# Altium project BEAGLEPLAYV020_220915.PrjPcb (part 8 of 10)

## Sheet 017_SoC CSI & OLDI.SchDoc
size 420 x 297 mm; Page Create Date: May 29, 2006; WebSite: https://www.seeedstudio.com; Variant Name: <Core Design>; Page Number: 17; Drawing: qxn; Schematic Name: BeaglePlay; Page Size: A3; Comment: Seeed Title; Page Count: 22; Page Name: 017_SoC CSI & OLDI; Company: Seeed Studio; RevCode: v0.2; DsnPath: C:\Users\a0488739\Documents\GitHub\beagleplay\allegro\DVT\BEAGLEPLAYV020_220915.DSN; SchematicName: BeaglePlay; PageName: 017_SoC CSI & OLDI; PageSize: A3; TopSchematic: True
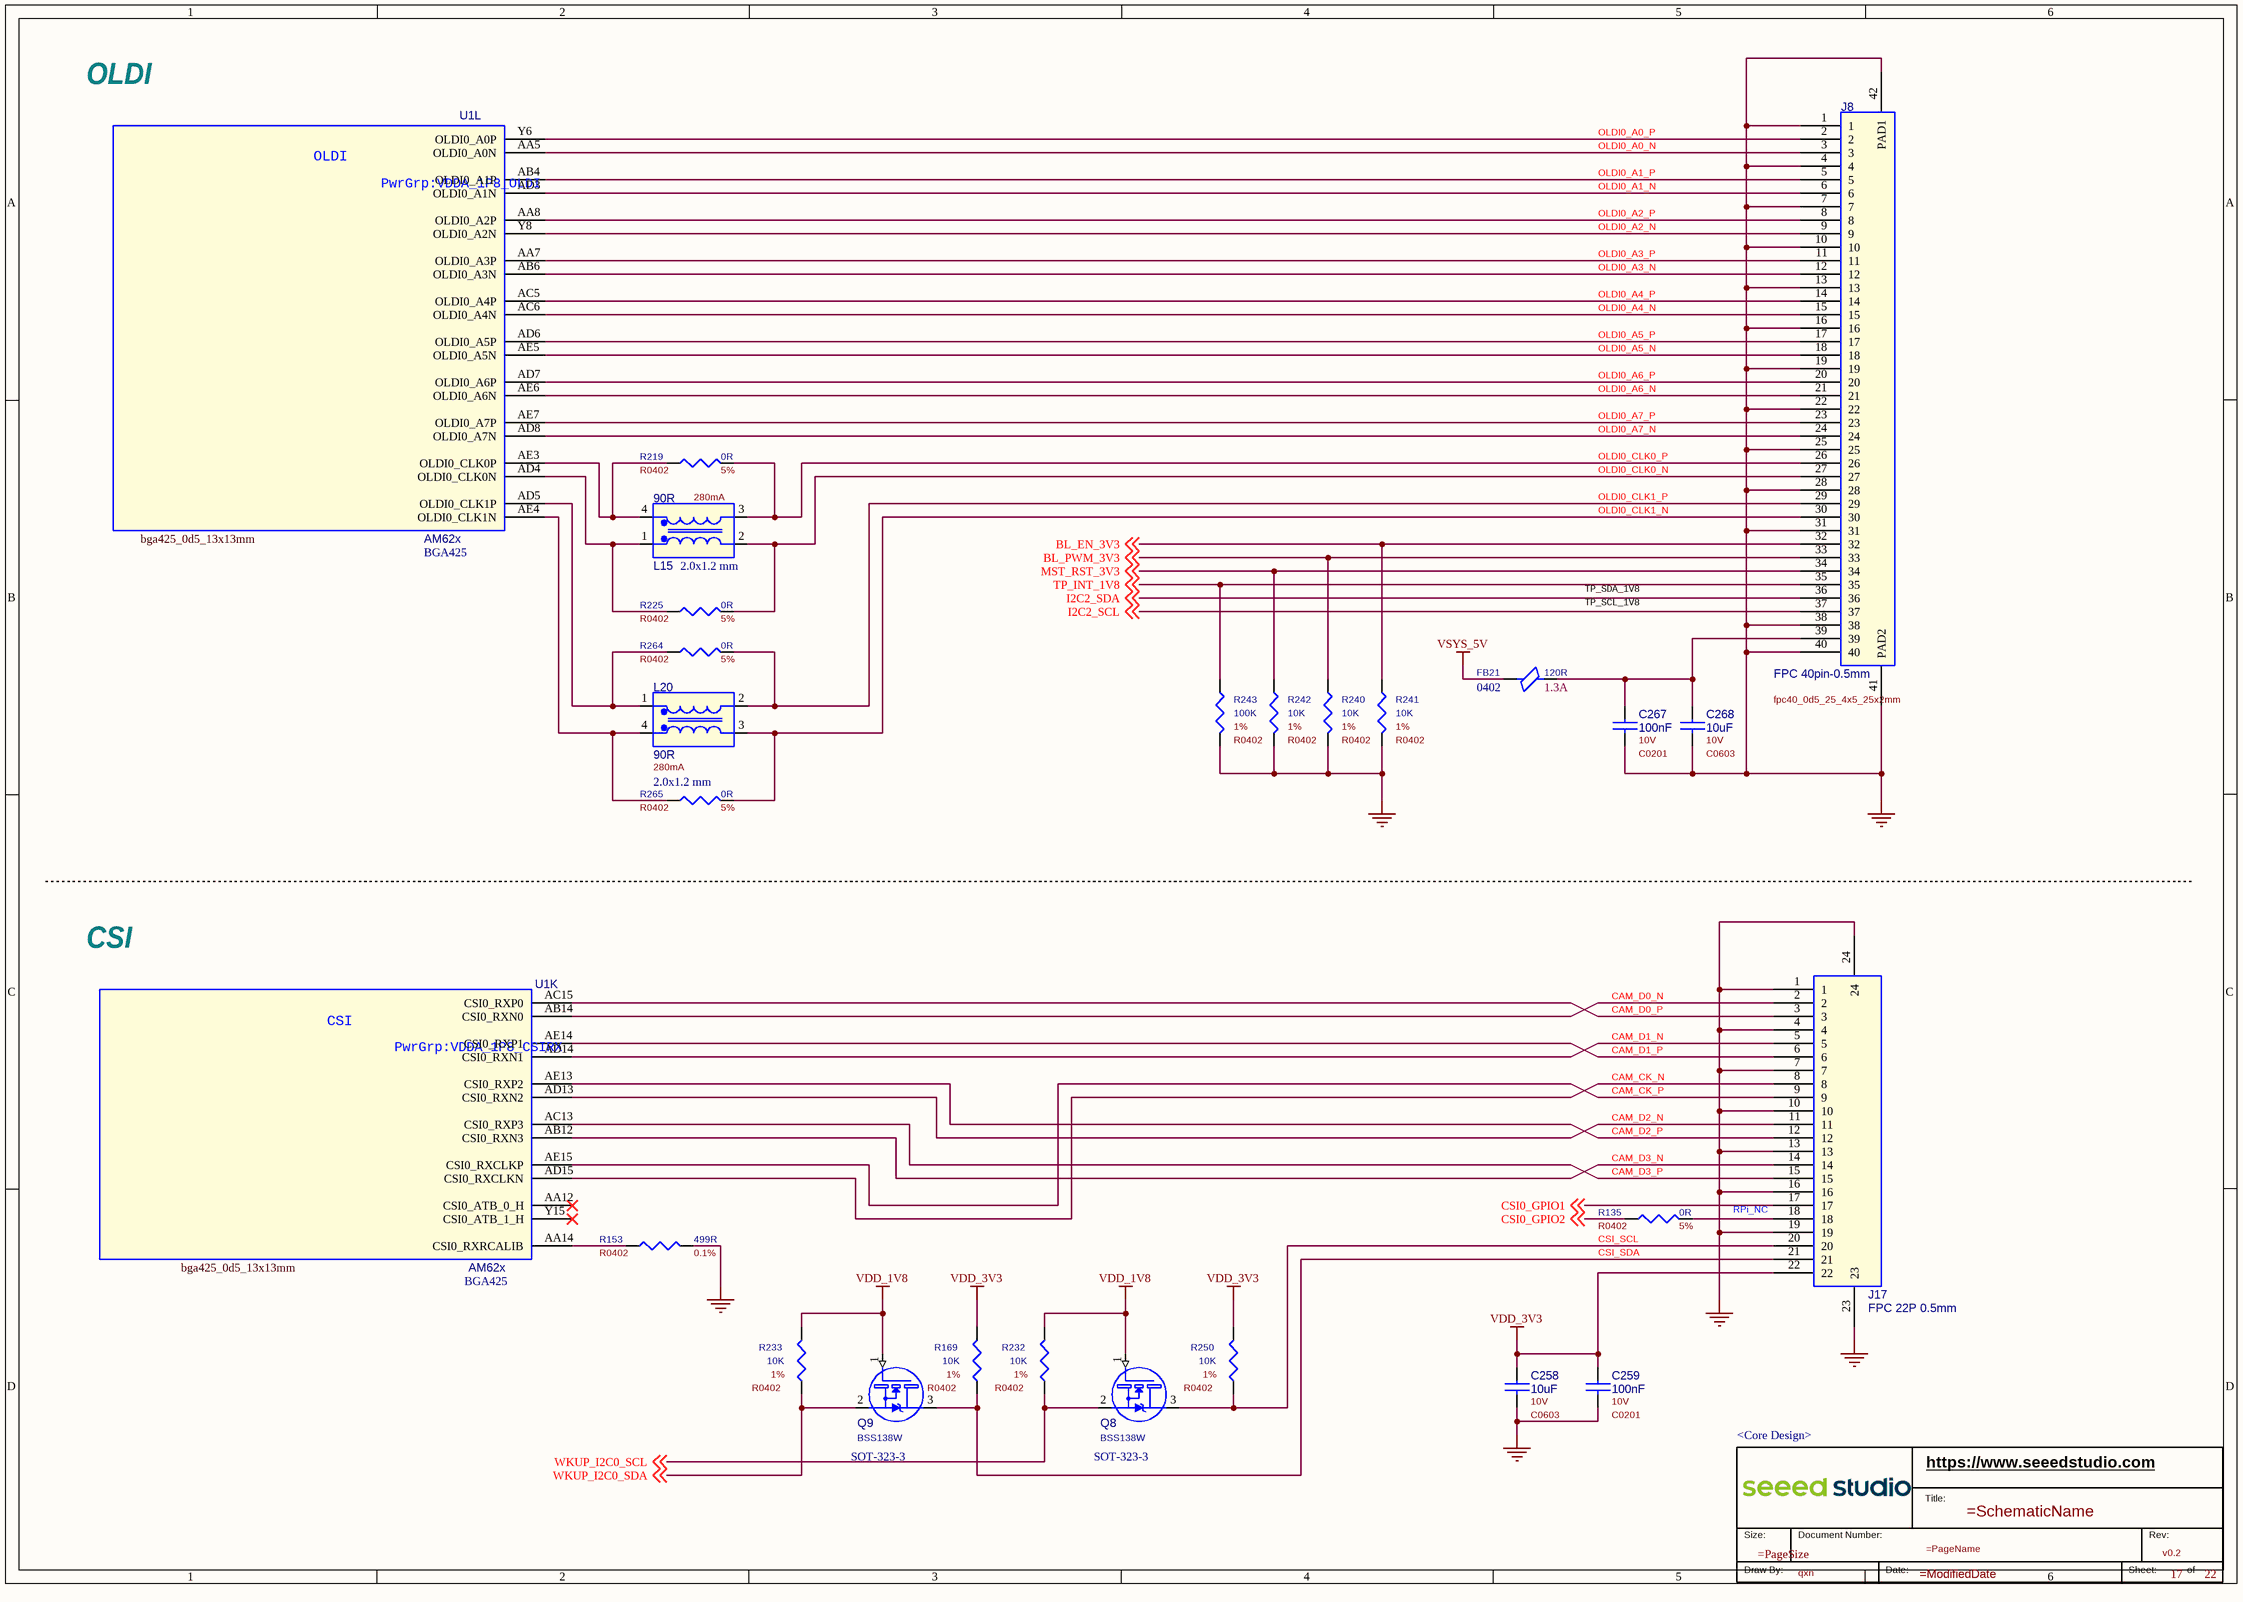
[diagram p16: 017_SoC CSI & OLDI.SchDoc]

### Parts
(Parts that share a designator on the sheet are numbered #1, #2 ... from top to bottom, then left to right.)
*#17  RevCode: v0.2  Page Number: 17  Page Count: 22  Drawing: qxn  Variant Name: <Core Design>  (hidden comment: Seeed Title)  (graphical)
C258  value 10uF  Rating: 10V  [C0603]  (hidden comment: CC)
C259  value 100nF  Rating: 10V  [C0201]  (hidden comment: CC)
C267  value 100nF  Rating: 10V  [C0201]  (hidden comment: CC)
C268  value 10uF  Rating: 10V  [C0603]  (hidden comment: CC)
FB21  value 120R  Rating: 1.3A  Package Size: 0402  [L0402]  (hidden comment: FB)
J8  value FPC 40pin-0.5mm  [fpc40_0d5_25_4x5_25x2mm]  (hidden comment: Header 40+2P)
J17  value FPC 22P 0.5mm  [fpc22_0d5_15_4x5_25x2mm_0d5_dx_npwb]  (hidden comment: FPC 22+2P)
L15  value 90R  Rating: 280mA  Package Size: 2.0x1.2 mm  [L2012]  (hidden comment: CL)
L20  value 90R  Rating: 280mA  Package Size: 2.0x1.2 mm  [L2012]  (hidden comment: CL)
Q8  value BSS138W  [SOT-323-3]  (hidden comment: NMOS_123)
Q9  value BSS138W  [SOT-323-3]  (hidden comment: NMOS_123)
R135  value 0R  Rating: 5%  [R0402]  (hidden comment: R)
R153  value 499R  Rating: 0.1%  [R0402]  (hidden comment: R)
R169  value 10K  Rating: 1%  [R0402]  (hidden comment: R)
R219  value 0R  Rating: 5%  [R0402]  (hidden comment: R)
R225  value 0R  Rating: 5%  [R0402]  (hidden comment: R)
R232  value 10K  Rating: 1%  [R0402]  (hidden comment: R)
R233  value 10K  Rating: 1%  [R0402]  (hidden comment: R)
R240  value 10K  Rating: 1%  [R0402]  (hidden comment: R)
R241  value 10K  Rating: 1%  [R0402]  (hidden comment: R)
R242  value 10K  Rating: 1%  [R0402]  (hidden comment: R)
R243  value 100K  Rating: 1%  [R0402]  (hidden comment: R)
R250  value 10K  Rating: 1%  [R0402]  (hidden comment: R)
R264  value 0R  Rating: 5%  [R0402]  (hidden comment: R)
R265  value 0R  Rating: 5%  [R0402]  (hidden comment: R)
U1  value AM62x  Package Size: BGA425  [bga425_0d5_13x13mm]  (hidden comment: AM62x_BGA425)  (parts K,L of 19)

### Nets
GND: C258.2 C259.2 C267.2 C268.2 J8.1 J8.4 J8.7 J8.10 J8.13 J8.16 J8.19 J8.22 J8.25 J8.28 J8.31 J8.38 J8.40 J8.41(PAD2) J8.42(PAD1) J17.1 J17.4 J17.7 J17.10 J17.13 J17.16 J17.19 J17.23 J17.24 R153.2 R240.2 R241.2 R242.2 R243.2
VDD_1V8: Q8.1(G) Q9.1(G) R232.1 R233.1
VDD_3V3: C258.1 C259.1 J17.22 R169.1 R250.1
VSYS_5V: FB21.1
BL_EN_3V3: J8.32 R241.1 ; off-sheet BL_EN_3V3
BL_PWM_3V3: J8.33 R240.1 ; off-sheet BL_PWM_3V3
CAM_CK_N: J17.8 U1.AD15(CSI0_RXCLKN)
CAM_CK_P: J17.9 U1.AE15(CSI0_RXCLKP)
CAM_D0_N: J17.2 U1.AB14(CSI0_RXN0)
CAM_D0_P: J17.3 U1.AC15(CSI0_RXP0)
CAM_D1_N: J17.5 U1.AD14(CSI0_RXN1)
CAM_D1_P: J17.6 U1.AE14(CSI0_RXP1)
CAM_D2_N: J17.11 U1.AD13(CSI0_RXN2)
CAM_D2_P: J17.12 U1.AE13(CSI0_RXP2)
CAM_D3_N: J17.14 U1.AB12(CSI0_RXN3)
CAM_D3_P: J17.15 U1.AC13(CSI0_RXP3)
CSI0_GPIO1: J17.17 ; off-sheet CSI0_GPIO1
CSI0_GPIO2: R135.1 ; off-sheet CSI0_GPIO2
CSI_SCL: J17.20 Q8.3(D) R250.2
CSI_SDA: J17.21 Q9.3(D) R169.2
I2C2_SCL: J8.37 ; off-sheet I2C2_SCL
I2C2_SDA: J8.36 ; off-sheet I2C2_SDA
MST_RST_3V3: J8.34 R242.1 ; off-sheet MST_RST_3V3
OLDI0_A0_N: J8.3 U1.AA5(OLDI0_A0N)
OLDI0_A0_P: J8.2 U1.Y6(OLDI0_A0P)
OLDI0_A1_N: J8.6 U1.AD3(OLDI0_A1N)
OLDI0_A1_P: J8.5 U1.AB4(OLDI0_A1P)
OLDI0_A2_N: J8.9 U1.Y8(OLDI0_A2N)
OLDI0_A2_P: J8.8 U1.AA8(OLDI0_A2P)
OLDI0_A3_N: J8.12 U1.AB6(OLDI0_A3N)
OLDI0_A3_P: J8.11 U1.AA7(OLDI0_A3P)
OLDI0_A4_N: J8.15 U1.AC6(OLDI0_A4N)
OLDI0_A4_P: J8.14 U1.AC5(OLDI0_A4P)
OLDI0_A5_N: J8.18 U1.AE5(OLDI0_A5N)
OLDI0_A5_P: J8.17 U1.AD6(OLDI0_A5P)
OLDI0_A6_N: J8.21 U1.AE6(OLDI0_A6N)
OLDI0_A6_P: J8.20 U1.AD7(OLDI0_A6P)
OLDI0_A7_N: J8.24 U1.AD8(OLDI0_A7N)
OLDI0_A7_P: J8.23 U1.AE7(OLDI0_A7P)
OLDI0_CLK0_N: J8.27 L15.2 R225.2
OLDI0_CLK0_P: J8.26 L15.3 R219.2
OLDI0_CLK1_N: J8.30 L20.3 R265.2
OLDI0_CLK1_P: J8.29 L20.2 R264.2
TP_INT_1V8: J8.35 R243.1 ; off-sheet TP_INT_1V8
WKUP_I2C0_SCL: Q8.2(S) R232.2 ; off-sheet WKUP_I2C0_SCL
WKUP_I2C0_SDA: Q9.2(S) R233.2 ; off-sheet WKUP_I2C0_SDA
NetC267_1: C267.1 C268.1 FB21.2 J8.39
NetJ17_18: J17.18 R135.2
NetL15_1: L15.1 R225.1 U1.AD4(OLDI0_CLK0N)
NetL15_4: L15.4 R219.1 U1.AE3(OLDI0_CLK0P)
NetL20_1: L20.1 R264.1 U1.AD5(OLDI0_CLK1P)
NetL20_4: L20.4 R265.1 U1.AE4(OLDI0_CLK1N)
NetR153_1: R153.1 U1.AA14(CSI0_RXRCALIB)

Not connected (* = marked no-connect by the designer): U1 AA12(CSI0_ATB_0_H)* Y15(CSI0_ATB_1_H)*

### Notes on the sheet
- OLDI
- TP_SDA_1V8
- TP_SCL_1V8
- CSI
- RPi_NC
- (in symbol AM62x_BGA425, part K) CSI; PwrGrp:VDDA_1P8_CSIRX
- (in symbol AM62x_BGA425, part L) OLDI; PwrGrp:VDDA_1P8_OLDI
- (in symbol Seeed Title) https://www.seeedstudio.com; Title:; Size:; Document Number:; Rev:; Draw By:; Date:; Sheet:; of

### Library data of the parts
*#17 = Seeed Title: Company: Seeed Studio; WebSite: https://www.seeedstudio.com; Schematic Name: =SchematicName; Page Size: =PageSize; Page Name: =PageName; Page Create Date: May 29, 2006; Page Modify Date: =ModifiedDate
C258 = CC: CAP, Ceramic, SMD, 10uF, 10%, 10V, 0603; Part Reference: C258; Manufacturer PN: CC0603KRX5R6BB106; Company Part Status: BeagleBone Carrier Board; Manufacturer: YAGEO; Manufacturer Part Number: CC0805MKX7R7BB106; CLASS: DISCRETE; Temperature Coefficient: X5R; PN: 302010103; PCB Footprint: C0603; Tolerance: 10%; Dielectric Type: Ceramic; Package Size: 0603; Part Type: Ceramic; Status: Sensecap Gateway V1; Temperature: -55¡ãC to 125¡ãC
C259 = CC: CAP, Ceramic, SMD, 100nF, 10%, 10V, 0201; Part Reference: C259; Manufacturer PN: CC0201KRX5R6BB104; Company Part Status: ODYSSEY-i.MX8M; Manufacturer: YAGEO; CLASS: DISCRETE; Temperature Coefficient: X5R; PN: 302010271; PCB Footprint: C0201; Tolerance: 10%; Dielectric Type: Ceramic; Package Size: 0201; Temperature: -55¡ãC to 85¡ãC; Status: ODYSSEY-i.MX8M; Part Type: Ceramic; Manufacturer Part Number: CC0201KRX5R6BB104
C267 = CC: CAP, Ceramic, SMD, 100nF, 10%, 10V, 0201; Part Reference: C267; Manufacturer PN: CC0201KRX5R6BB104; Manufacturer: YAGEO; Company Part Status: ODYSSEY-i.MX8M; CLASS: DISCRETE; Temperature Coefficient: X5R; PN: 302010271; PCB Footprint: C0201; Tolerance: 10%; Dielectric Type: Ceramic; Package Size: 0201
C268 = CC: CAP, Ceramic, SMD, 10uF, 10%, 10V, 0603; Part Reference: C268; Manufacturer PN: CC0603KRX5R6BB106; Manufacturer: YAGEO; Company Part Status: BeagleBone Carrier Board; CLASS: DISCRETE; Temperature Coefficient: X5R; PN: 302010103; PCB Footprint: C0603; Tolerance: 10%; Dielectric Type: Ceramic; Package Size: 0603
FB21 = FB: Ferrite Bead, 120R, , 1.3A, 0402; Part Reference: FB21; Company Part Status: BeagleBone Carrier Board; Manufacturer: Murata; Manufacturer PN: BLM15PD121SN1D; PN: 303030040; CLASS: DISCRETE; PCB Footprint: L0402
J8 = Header 40+2P: CONN, FPC Connectors, 0.5K-DX-40PWB, 40P, SMD; Part Reference: J8; Company Part Status: BeaglePlay; Manufacturer: BEST Electronics; PN: 320060264; CLASS: IO; PCB Footprint: fpc40_0d5_25_4x5_25x2mm; Package Size: 40P-0.50mm; Manufacturer PN: 0.5K-DX-40PWB
J17 = FPC 22+2P: CONN, FPC Connectors, FPC 22P 0.5mm, 22P+2P, SMD; Part Reference: J17; Manufacturer Part Number: 0.5K-DX-22PWB; Manufacturer: BEST Electronics; Company Part Status: BeaglePlay; Priority: A; PN: 320060764; CLASS: IO; PCB Footprint: fpc22_0d5_15_4x5_25x2mm_0d5_dx_npwb; Temperature: -25¡ãC to 85¡ãC; Status: BeagleBone AI TDA4VM; Part Type: FPC Connector; Package Size: 20P-0.5mm; Manufacturer PN: 0.5K-DX-22PWB
L15 = CL: Common Mode Filter, 90R, --, 280mA, 2.0x1.2 mm; Part Reference: L15; Company Part Status: BBAI; Manufacturer: Murata; Manufacturer PN: DLW21SN900HQ2L; PN: 303050266; CLASS: DISCRETE; PCB Footprint: L2012
L20 = CL: Common Mode Filter, 90R, --, 280mA, 2.0x1.2 mm; Part Reference: L20; Manufacturer PN: DLW21SN900HQ2L; Manufacturer: Murata; Company Part Status: BBAI; CLASS: DISCRETE; PN: 303050266; PCB Footprint: L2012
Q8 = NMOS_123: XSTR, MOSFET, N-Channel, BSS138W, 50V, 200mA, SOT-323-3, SMD; Part Reference: Q8; Company Part Status: BeagleBone Carrier Board; Manufacturer: Diodes; Manufacturer PN: BSS138W-7-F; PN: 305030000; CLASS: DISCRETE; PCB Footprint: SOT-323-3; Package Size: SOT-323-3; Polarity: N-Channel
Q9 = NMOS_123: XSTR, MOSFET, N-Channel, BSS138W, 50V, 200mA, SOT-323-3, SMD; Part Reference: Q9; Company Part Status: BeagleBone Carrier Board; Manufacturer: Diodes; Manufacturer PN: BSS138W-7-F; PN: 305030000; CLASS: DISCRETE; PCB Footprint: SOT-323-3; Package Size: SOT-323-3; Polarity: N-Channel
R135 = R: RES, Thick Film, 0R, 5%, 1/16W, SMD, 0402; Part Reference: R135; Manufacturer PN: RC0402JR-070RL; Company Part Status: BeagleBone Carrier Board; Manufacturer Part Number: RC0201FR-070RL; Manufacturer: YAGEO; CLASS: DISCRETE; PN: 301010000; PCB Footprint: R0402; Rated Power: 1/16W; Package Size: 0402; Temperature: -55¡ãC to 125¡ãC; Status: BeagleBone AI TDA4VM; Part Type: RES
R153 = R: RES, Thick Film, 499R, 0.1%, 1/16W, SMD, 0402; Part Reference: R153; Company Part Status: Beaglebone LoRa Gateway; Manufacturer: YAGEO; Manufacturer PN: RT0402BRE07499RL; PN: 301010848; CLASS: DISCRETE; PCB Footprint: R0402; Package Size: 0402; Rated Power: 1/16W
R169 = R: RES, Thick Film, 10K, 1%, 1/16W, SMD, 0402; Part Reference: R169; Company Part Status: BeagleBone Carrier Board; Manufacturer: YAGEO; Manufacturer PN: RC0402FR-0710KL; PN: 301010047; CLASS: DISCRETE; PCB Footprint: R0402; Package Size: 0402; Rated Power: 1/16W
R219 = R: RES, Thick Film, 0R, 5%, 1/16W, SMD, 0402; Part Reference: R219; Manufacturer: YAGEO; Manufacturer Part Number: RC0201FR-070RL; Company Part Status: BeagleBone Carrier Board; Manufacturer PN: RC0402JR-070RL; PN: 301010000; CLASS: DISCRETE; PCB Footprint: R0402; Part Type: RES; Status: BeagleBone AI TDA4VM; Temperature: -55¡ãC to 125¡ãC; Package Size: 0402; Rated Power: 1/16W
R225 = R: RES, Thick Film, 0R, 5%, 1/16W, SMD, 0402; Part Reference: R225; Manufacturer: YAGEO; Manufacturer Part Number: RC0201FR-070RL; Company Part Status: BeagleBone Carrier Board; Manufacturer PN: RC0402JR-070RL; PN: 301010000; CLASS: DISCRETE; PCB Footprint: R0402; Part Type: RES; Status: BeagleBone AI TDA4VM; Temperature: -55¡ãC to 125¡ãC; Package Size: 0402; Rated Power: 1/16W
R232 = R: RES, Thick Film, 10K, 1%, 1/16W, SMD, 0402; Part Reference: R232; Manufacturer PN: RC0402FR-0710KL; Manufacturer: YAGEO; Company Part Status: BeagleBone Carrier Board; CLASS: DISCRETE; PN: 301010047; PCB Footprint: R0402; Package Size: 0402; Rated Power: 1/16W
R233 = R: RES, Thick Film, 10K, 1%, 1/16W, SMD, 0402; Part Reference: R233; Manufacturer PN: RC0402FR-0710KL; Manufacturer: YAGEO; Company Part Status: BeagleBone Carrier Board; CLASS: DISCRETE; PN: 301010047; PCB Footprint: R0402; Package Size: 0402; Rated Power: 1/16W
R240 = R: RES, Thick Film, 10K, 1%, 1/16W, SMD, 0402; Part Reference: R240; Manufacturer PN: RC0402FR-0710KL; Company Part Status: BeagleBone Carrier Board; Manufacturer Part Number: RC0201FR-0710KL; Manufacturer: YAGEO; CLASS: DISCRETE; PN: 301010047; PCB Footprint: R0402; Package Size: 0402; Temperature: -55¡ãC to 125¡ãC; Status: BeagleBone AI TDA4VM; Part Type: RES; Rated Power: 1/16W
R241 = R: RES, Thick Film, 10K, 1%, 1/16W, SMD, 0402; Part Reference: R241; Manufacturer PN: RC0402FR-0710KL; Company Part Status: BeagleBone Carrier Board; Manufacturer Part Number: RC0201FR-0710KL; Manufacturer: YAGEO; CLASS: DISCRETE; PN: 301010047; PCB Footprint: R0402; Package Size: 0402; Temperature: -55¡ãC to 125¡ãC; Status: BeagleBone AI TDA4VM; Part Type: RES; Rated Power: 1/16W
R242 = R: RES, Thick Film, 10K, 1%, 1/16W, SMD, 0402; Part Reference: R242; Manufacturer PN: RC0402FR-0710KL; Company Part Status: BeagleBone Carrier Board; Manufacturer Part Number: RC0201FR-0710KL; Manufacturer: YAGEO; CLASS: DISCRETE; PN: 301010047; PCB Footprint: R0402; Package Size: 0402; Temperature: -55¡ãC to 125¡ãC; Status: BeagleBone AI TDA4VM; Part Type: RES; Rated Power: 1/16W
R243 = R: RES, Thick Film, 100K, 1%, 1/16W, SMD, 0402; Part Reference: R243; Manufacturer PN: RC0402FR-07100KL; Company Part Status: BeagleBone Carrier Board; Manufacturer Part Number: RC0201FR-0710KL; Manufacturer: YAGEO; CLASS: DISCRETE; PN: 301010456; PCB Footprint: R0402; Package Size: 0402; Temperature: -55¡ãC to 125¡ãC; Status: BeagleBone AI TDA4VM; Part Type: RES; Rated Power: 1/16W
R250 = R: RES, Thick Film, 10K, 1%, 1/16W, SMD, 0402; Part Reference: R250; Company Part Status: BeagleBone Carrier Board; Manufacturer: YAGEO; Manufacturer PN: RC0402FR-0710KL; PN: 301010047; CLASS: DISCRETE; PCB Footprint: R0402; Package Size: 0402; Rated Power: 1/16W
R264 = R: RES, Thick Film, 0R, 5%, 1/16W, SMD, 0402; Part Reference: R264; Manufacturer: YAGEO; Manufacturer Part Number: RC0201FR-070RL; Company Part Status: BeagleBone Carrier Board; Manufacturer PN: RC0402JR-070RL; PN: 301010000; CLASS: DISCRETE; PCB Footprint: R0402; Part Type: RES; Status: BeagleBone AI TDA4VM; Temperature: -55¡ãC to 125¡ãC; Package Size: 0402; Rated Power: 1/16W
R265 = R: RES, Thick Film, 0R, 5%, 1/16W, SMD, 0402; Part Reference: R265; Manufacturer: YAGEO; Manufacturer Part Number: RC0201FR-070RL; Company Part Status: BeagleBone Carrier Board; Manufacturer PN: RC0402JR-070RL; PN: 301010000; CLASS: DISCRETE; PCB Footprint: R0402; Part Type: RES; Status: BeagleBone AI TDA4VM; Temperature: -55¡ãC to 125¡ãC; Package Size: 0402; Rated Power: 1/16W
U1 = AM62x_BGA425: IC, Controller, MPU, AM62x, BGA425; Part Reference: U1; Manufacturer PN: AM6254ATCGGHALWR; Manufacturer: TI; Company Part Status: BeaglePlay; PN: 310011537; PCB Footprint: bga425_0d5_13x13mm; CLASS: IC

## Sheet 018_RTC & ID & DEBUG.SchDoc
size 420 x 297 mm; Page Create Date: May 29, 2006; WebSite: https://www.seeedstudio.com; Variant Name: <Core Design>; Page Number: 18; Drawing: qxn; Schematic Name: BeaglePlay; Page Size: A3; Comment: Seeed Title; Page Count: 22; Page Name: 018_RTC & ID & DEBUG; Company: Seeed Studio; RevCode: v0.2; DsnPath: C:\Users\a0488739\Documents\GitHub\beagleplay\allegro\DVT\BEAGLEPLAYV020_220915.DSN; SchematicName: BeaglePlay; PageName: 018_RTC & ID & DEBUG; PageSize: A3; TopSchematic: True
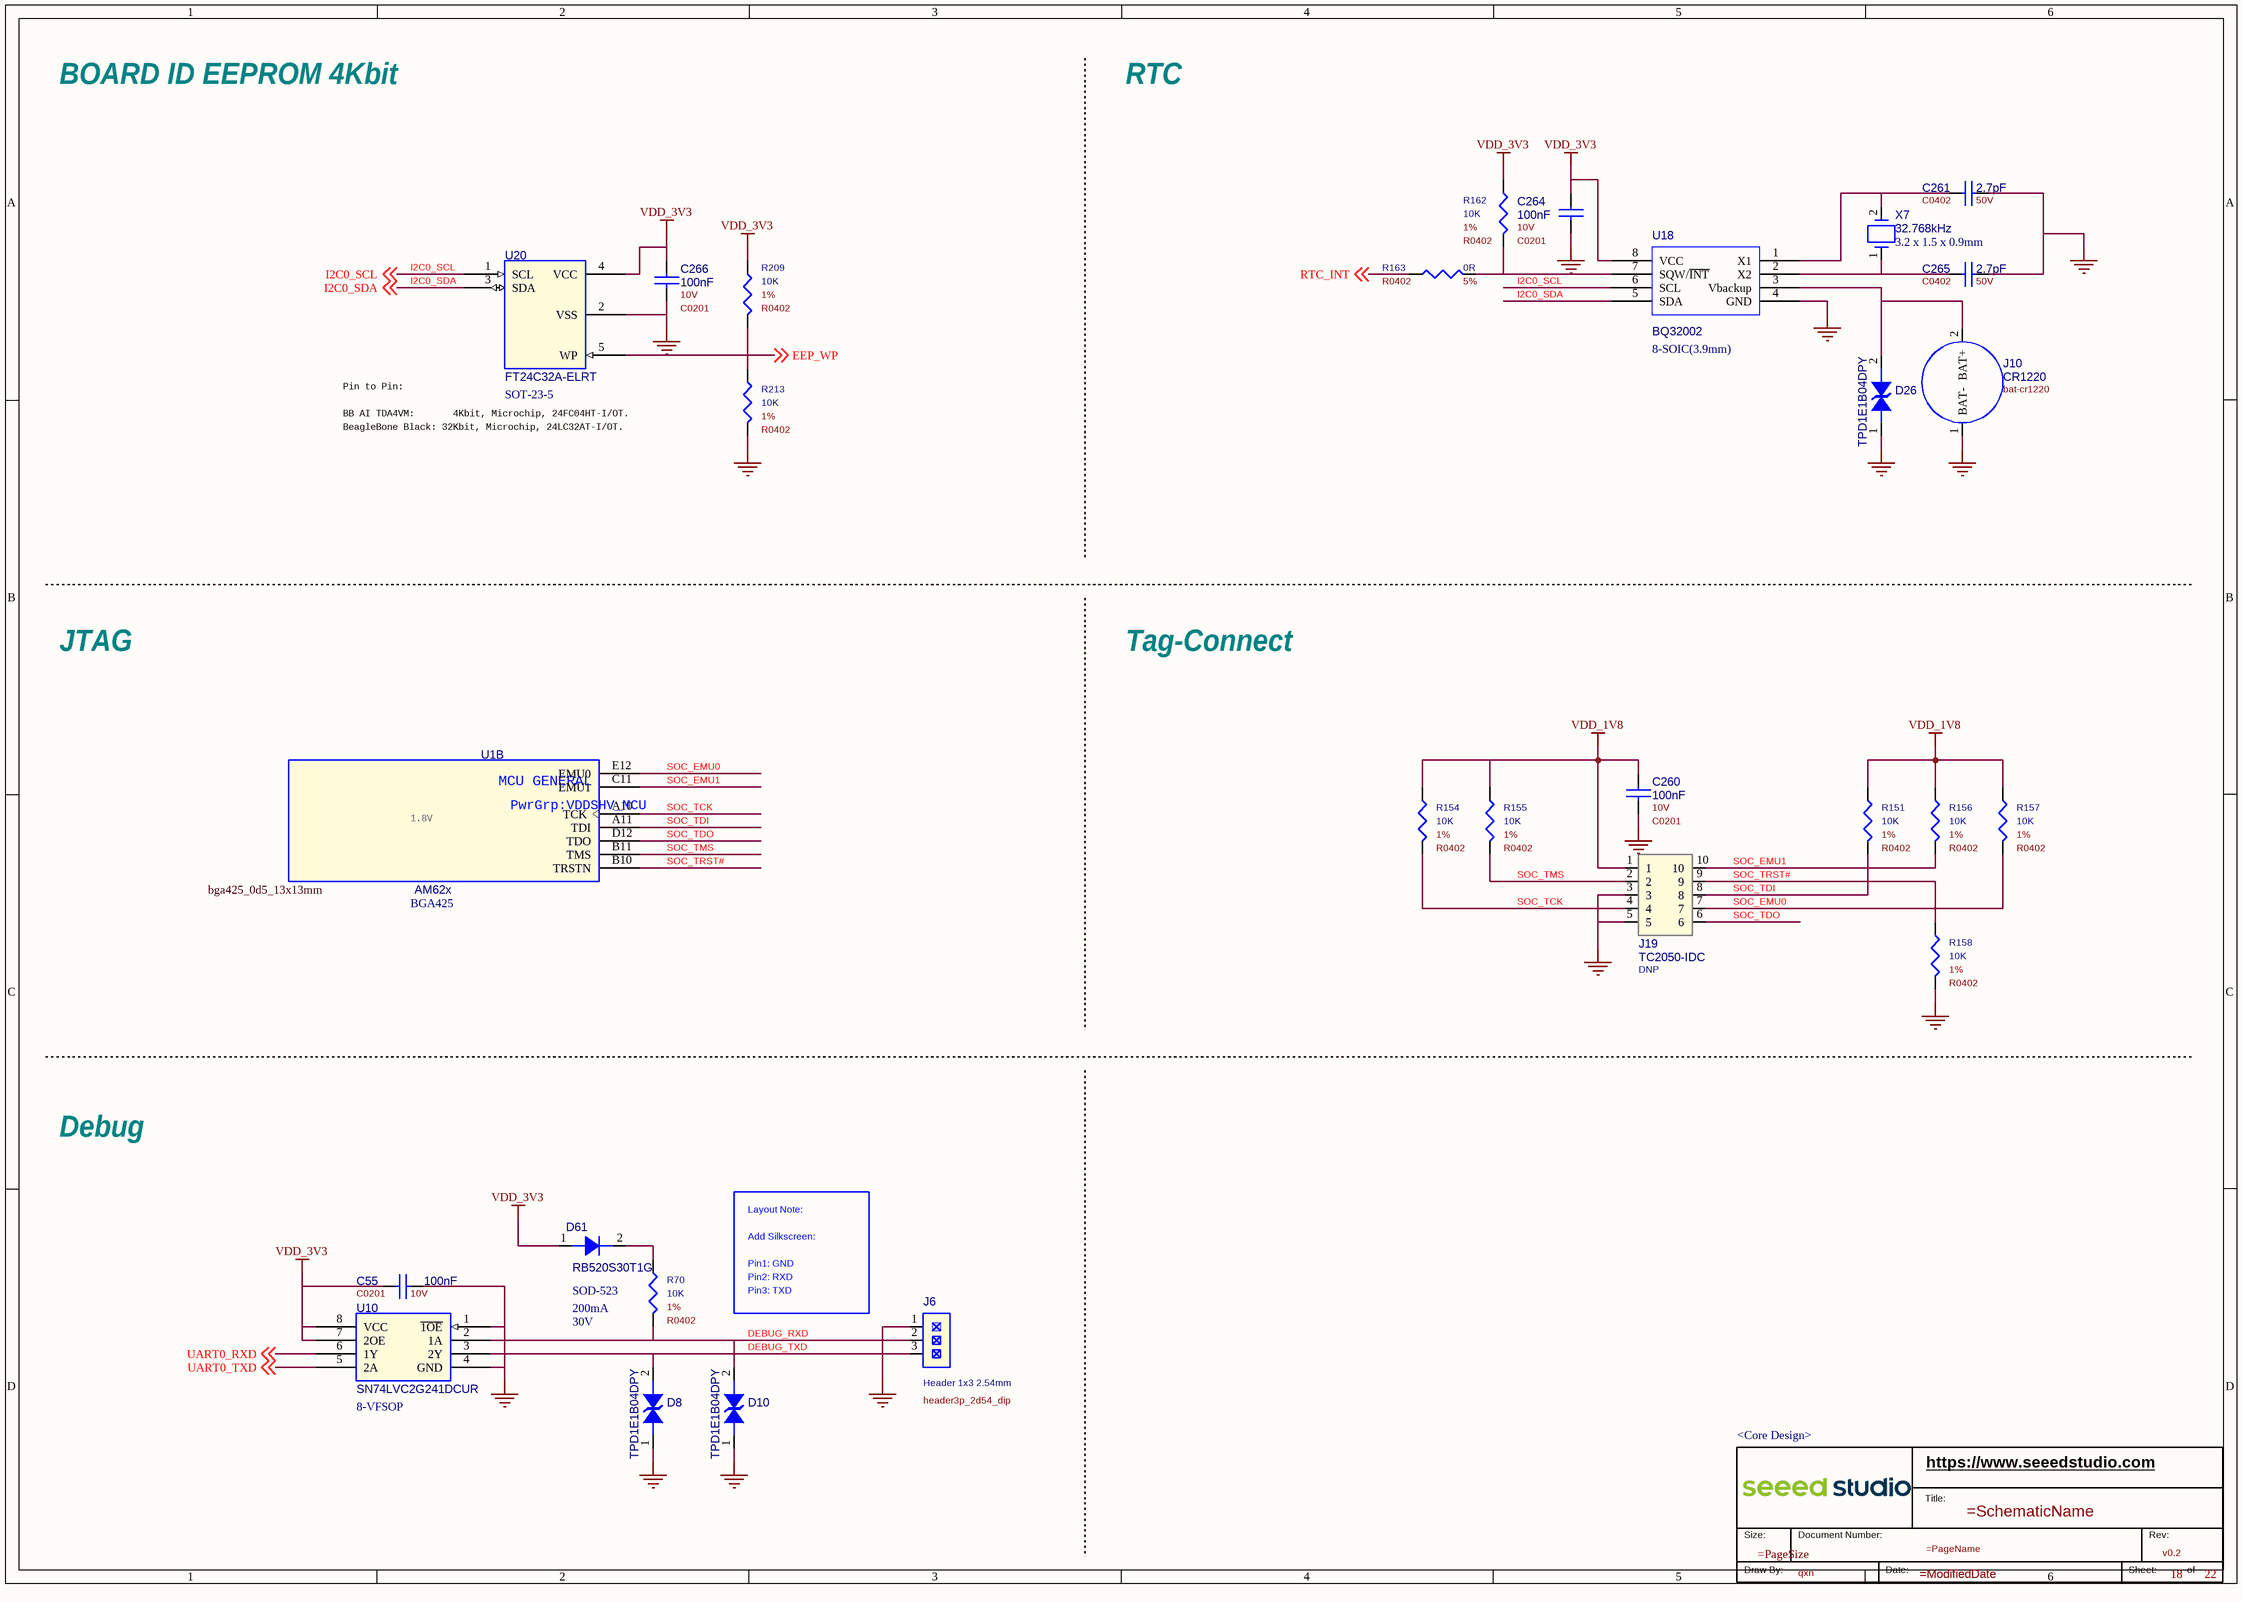
[diagram p17: 018_RTC & ID & DEBUG.SchDoc]

### Parts
(Parts that share a designator on the sheet are numbered #1, #2 ... from top to bottom, then left to right.)
*#18  RevCode: v0.2  Page Number: 18  Page Count: 22  Drawing: qxn  Variant Name: <Core Design>  (hidden comment: Seeed Title)  (graphical)
C55  value 100nF  Rating: 10V  [C0201]  (hidden comment: CC)
C260  value 100nF  Rating: 10V  [C0201]  (hidden comment: CC)
C261  value 2.7pF  Rating: 50V  [C0402]  (hidden comment: CC)
C264  value 100nF  Rating: 10V  [C0201]  (hidden comment: CC)
C265  value 2.7pF  Rating: 50V  [C0402]  (hidden comment: CC)
C266  value 100nF  Rating: 10V  [C0201]  (hidden comment: CC)
D8  value TPD1E1B04DPY  [D0402]  (hidden comment: DIODE TVS BI-DIR)
D10  value TPD1E1B04DPY  [D0402]  (hidden comment: DIODE TVS BI-DIR)
D26  value TPD1E1B04DPY  [D0402]  (hidden comment: DIODE TVS BI-DIR)
D61  value RB520S30T1G  Repetitive Reverse Voltage Maximum: 30V  Peak Forward Current: 200mA  Package Size: SOD-523  [sod_523]  (hidden comment: D)
J6  value Header 1x3 2.54mm  [header3p_2d54_dip]  (hidden comment: Header 1x3)
J10  value CR1220  [bat-cr1220]  (hidden comment: BAT Holder 2P)
J19  value TC2050-IDC  ASSY: DNP  [Connect10_1d27_12_4x6_7mm]  (hidden comment: Header 2X5_1)
R70  value 10K  Rating: 1%  [R0402]  (hidden comment: R)
R151  value 10K  Rating: 1%  [R0402]  (hidden comment: R)
R154  value 10K  Rating: 1%  [R0402]  (hidden comment: R)
R155  value 10K  Rating: 1%  [R0402]  (hidden comment: R)
R156  value 10K  Rating: 1%  [R0402]  (hidden comment: R)
R157  value 10K  Rating: 1%  [R0402]  (hidden comment: R)
R158  value 10K  Rating: 1%  [R0402]  (hidden comment: R)
R162  value 10K  Rating: 1%  [R0402]  (hidden comment: R)
R163  value 0R  Rating: 5%  [R0402]  (hidden comment: R)
R209  value 10K  Rating: 1%  [R0402]  (hidden comment: R)
R213  value 10K  Rating: 1%  [R0402]  (hidden comment: R)
U1  value AM62x  Package Size: BGA425  [bga425_0d5_13x13mm]  (hidden comment: AM62x_BGA425)  (part B of 19)
U10  value SN74LVC2G241DCUR  Package Size: 8-VFSOP  [U_8_DCU]  (hidden comment: SN74LVC2G241)
U18  value BQ32002  Package Size: 8-SOIC(3.9mm)  [soic8_1d27_4_9x3_9mm]  (hidden comment: DS1339_8P)
U20  value FT24C32A-ELRT  Package Size: SOT-23-5  [sot23-5]  (hidden comment: MEM_24LC32_SOT23-5)
X7  value 32.768kHz  Package Size: 3.2 x 1.5 x 0.9mm  [X2_SMD_3_2X1_5MM]  (hidden comment: XTAL_2P)

### Nets
GND: C55.2 C260.2 C261.2 C264.2 C265.2 C266.2 D8.1 D10.1 D26.1 J6.1 J10.1(BAT-) J19.3 J19.5 R158.2 R213.2 U10.1(~{1OE}) U10.4(GND) U18.4(GND) U20.2(VSS)
VDD_1V8: C260.1 J19.1 R151.1 R154.1 R155.1 R156.1 R157.1
VDD_3V3: C55.1 C264.1 C266.1 D61.1(A) R162.1 R209.1 U10.7(2OE) U10.8(VCC) U18.8(VCC) U20.4(VCC)
DEBUG_RXD: D10.2 J6.2 R70.2 U10.2(1A)
DEBUG_TXD: D8.2 J6.3 U10.3(2Y)
EEP_WP: R209.2 R213.1 U20.5(WP) ; off-sheet EEP_WP
I2C0_SCL: U18.6(SCL) U20.1(SCL) ; off-sheet I2C0_SCL
I2C0_SDA: U18.5(SDA) U20.3(SDA) ; off-sheet I2C0_SDA
RTC_INT: R163.1 ; off-sheet RTC_INT
SOC_EMU0: J19.7 R157.2 U1.E12(EMU0)
SOC_EMU1: J19.10 R156.2 U1.C11(EMU1)
SOC_TCK: J19.4 R154.2 U1.A10(TCK)
SOC_TDI: J19.8 R151.2 U1.A11(TDI)
SOC_TDO: J19.6 U1.D12(TDO)
SOC_TMS: J19.2 R155.2 U1.B11(TMS)
SOC_TRST#: J19.9 R158.1 U1.B10(TRSTN)
UART0_RXD: U10.6(1Y) ; off-sheet UART0_RXD
UART0_TXD: U10.5(2A) ; off-sheet UART0_TXD
NetC261_1: C261.1 U18.1(X1) X7.2
NetC265_1: C265.1 U18.2(X2) X7.1
NetD26_2: D26.2 J10.2(BAT+) U18.3(Vbackup)
NetD61_2: D61.2(C) R70.1
NetR162_2: R162.2 R163.2 U18.7(SQW/~{INT})

### Notes on the sheet
- BOARD ID EEPROM 4Kbit
- RTC
- Pin to Pin:
- BB AI TDA4VM:       4Kbit, Microchip, 24FC04HT-I/OT.
- BeagleBone Black: 32Kbit, Microchip, 24LC32AT-I/OT.
- JTAG
- Tag-Connect
- 1.8V
- Debug
- Add Silkscreen:
- Layout Note:
- Pin1: GND
- Pin2: RXD
- Pin3: TXD
- (in symbol AM62x_BGA425, part B) MCU GENERAL; PwrGrp:VDDSHV_MCU
- (in symbol Seeed Title) https://www.seeedstudio.com; Title:; Size:; Document Number:; Rev:; Draw By:; Date:; Sheet:; of

### Library data of the parts
*#18 = Seeed Title: Company: Seeed Studio; WebSite: https://www.seeedstudio.com; Schematic Name: =SchematicName; Page Size: =PageSize; Page Name: =PageName; Page Create Date: May 29, 2006; Page Modify Date: =ModifiedDate
C55 = CC: CAP, Ceramic, SMD, 100nF, 10%, 10V, 0201; Part Reference: C55; Manufacturer: YAGEO; Manufacturer Part Number: CC0201KRX5R6BB104; Company Part Status: ODYSSEY-i.MX8M; PN: 302010271; Temperature Coefficient: X5R; CLASS: DISCRETE; PCB Footprint: C0201; Part Type: Ceramic; Status: ODYSSEY-i.MX8M; Temperature: -55¡ãC to 85¡ãC; Package Size: 0201; Dielectric Type: Ceramic; Tolerance: 10%; Manufacturer PN: CC0201KRX5R6BB104
C260 = CC: CAP, Ceramic, SMD, 100nF, 10%, 10V, 0201; Part Reference: C260; Manufacturer Part Number: CC0201KRX5R6BB104; Manufacturer: YAGEO; Company Part Status: ODYSSEY-i.MX8M; PN: 302010271; Temperature Coefficient: X5R; CLASS: DISCRETE; PCB Footprint: C0201; Temperature: -55¡ãC to 85¡ãC; Status: ODYSSEY-i.MX8M; Part Type: Ceramic; Package Size: 0201; Dielectric Type: Ceramic; Tolerance: 10%; Manufacturer PN: CC0201KRX5R6BB104
C261 = CC: CAP, Ceramic, SMD, 2.7pF, 0.25pF, 50V, 0402; Part Reference: C261; Manufacturer PN: GCM1555C1H2R7CA16D; Manufacturer: Murata; Company Part Status: Combox Pro; Manufacturer Part Number: Murata;GCM1555C1H2R7CA16D; CLASS: DISCRETE; Temperature Coefficient: NP0; PN: 302011569; SIGNAL_MODEL: DEFAULT_CAPACITOR_22.000000pF_1_2; PCB Footprint: C0402; Tolerance: 0.25pF; Dielectric Type: Ceramic; Package Size: 0402; Status: Combox Pro; Part Type: Ceramic
C264 = CC: CAP, Ceramic, SMD, 100nF, 10%, 10V, 0201; Part Reference: C264; Manufacturer PN: CC0201KRX5R6BB104; Manufacturer: YAGEO; Company Part Status: ODYSSEY-i.MX8M; Manufacturer Part Number: Murata;GRM155R71C104KA88D; CLASS: DISCRETE; Temperature Coefficient: X5R; PN: 302010271; SIGNAL_MODEL: DEFAULT_CAPACITOR_100000pF_1_2; PCB Footprint: C0201; Tolerance: 10%; Dielectric Type: Ceramic; Package Size: 0201; Part Type: Ceramic; Status: Combox Pro
C265 = CC: CAP, Ceramic, SMD, 2.7pF, 0.25pF, 50V, 0402; Part Reference: C265; Manufacturer PN: GCM1555C1H2R7CA16D; Manufacturer: Murata; Company Part Status: Combox Pro; Manufacturer Part Number: Murata;GCM1555C1H2R7CA16D; CLASS: DISCRETE; Temperature Coefficient: NP0; PN: 302011569; SIGNAL_MODEL: DEFAULT_CAPACITOR_22.000000pF_1_2; PCB Footprint: C0402; Tolerance: 0.25pF; Dielectric Type: Ceramic; Package Size: 0402; Part Type: Ceramic; Status: Combox Pro
C266 = CC: CAP, Ceramic, SMD, 100nF, 10%, 10V, 0201; Part Reference: C266; Manufacturer PN: CC0201KRX5R6BB104; Company Part Status: ODYSSEY-i.MX8M; Manufacturer: YAGEO; CLASS: DISCRETE; Temperature Coefficient: X5R; PN: 302010271; PCB Footprint: C0201; Tolerance: 10%; Dielectric Type: Ceramic; Package Size: 0201; Manufacturer Part Number: CC0201KRX5R6BB104; Part Type: Ceramic; Status: ODYSSEY-i.MX8M; Temperature: -55¡ãC to 85¡ãC
D8 = DIODE TVS BI-DIR: DIO, ESD, TPD1E1B04DPY, --, 3.6V, --, X1SON(2); Part Reference: D8; Manufacturer: TI; Manufacturer Part Number: TPD1E1B04DPYR/T; Company Part Status: Grove Base Cape for PocketBeagle; Manufacturer PN: TPD1E1B04DPYR; PN: 304050798; CLASS: DISCRETE; PCB Footprint: D0402; Part Type: ESD; Status: Grove Base Cape for PocketBeagle; Temperature: -40¡ãC to 125¡ãC; Package Size: X1SON(2); Rated Voltage: 3.6V
D10 = DIODE TVS BI-DIR: DIO, ESD, TPD1E1B04DPY, --, 3.6V, --, X1SON(2); Part Reference: D10; Manufacturer: TI; Manufacturer Part Number: TPD1E1B04DPYR/T; Company Part Status: Grove Base Cape for PocketBeagle; Manufacturer PN: TPD1E1B04DPYR; PN: 304050798; CLASS: DISCRETE; PCB Footprint: D0402; Part Type: ESD; Status: Grove Base Cape for PocketBeagle; Temperature: -40¡ãC to 125¡ãC; Package Size: X1SON(2); Rated Voltage: 3.6V
D26 = DIODE TVS BI-DIR: DIO, ESD, TPD1E1B04DPY, --, 3.6V, --, X1SON(2); Part Reference: D26; Manufacturer Part Number: TPD1E1B04DPYR/T; Manufacturer: TI; Company Part Status: Grove Base Cape for PocketBeagle; Manufacturer PN: TPD1E1B04DPYR; PN: 304050798; CLASS: DISCRETE; PCB Footprint: D0402; Temperature: -40¡ãC to 125¡ãC; Status: Grove Base Cape for PocketBeagle; Part Type: ESD; Package Size: X1SON(2); Rated Voltage: 3.6V
D61 = D: DIO, Schottky, RB520S30T1G, , , , SOD-523; Part Reference: D61; Manufacturer: ON; Company Part Status: SCG Vehicle Device; CLASS: DISCRETE; PN: 304020782; PCB Footprint: sod_523; Manufacturer PN: RB520S30T1G
J6 = Header 1x3: CONN, Header, 1*3P, DIP; Part Reference: J6; Company Part Status: ST; Manufacturer: Yuxi Electronics; Manufacturer PN: P125-1103A1BS116A1; PN: 320020079; CLASS: IO; PCB Footprint: header3p_2d54_dip; Package Size: 1*3P-2.54-2.54-11.6/3.0mm
J10 = BAT Holder 2P: CONN, BAT Holder, , SMD; Part Reference: J10; Company Part Status: BeagleBone Carrier Board; Manufacturer: HongKeWei; Manufacturer PN: BS-12-B3AA003; PN: 320170000; CLASS: IO; PCB Footprint: bat-cr1220; Package Size: CR1220-15.06*13.00*H4.1mm
J19 = Header 2X5_1: CONN, Header, TC2050-IDC, 2*5P, SMD; Part Reference: J19; Company Part Status: RV PI; PN: TMP-43; CLASS: IO; PCB Footprint: Connect10_1d27_12_4x6_7mm
R70 = R: RES, Thick Film, 10K, 1%, 1/16W, SMD, 0402; Part Reference: R70; Manufacturer PN: RC0402FR-0710KL; Company Part Status: BeagleBone Carrier Board; Manufacturer Part Number: RC0402FR-074K7L; Manufacturer: YAGEO; CLASS: DISCRETE; PN: 301010047; PCB Footprint: R0402; Rated Power: 1/16W; Package Size: 0402; Temperature: -55¡ãC to 155¡ãC; Status: BeagleBone Carrier Board; Part Type: RES
R151 = R: RES, Thick Film, 10K, 1%, 1/16W, SMD, 0402; Part Reference: R151; Manufacturer PN: RC0402FR-0710KL; Company Part Status: BeagleBone Carrier Board; Manufacturer: YAGEO; Manufacturer Part Number: RC0201FR-0710KL; CLASS: DISCRETE; PN: 301010047; PCB Footprint: R0402; Rated Power: 1/16W; Package Size: 0402; Part Type: RES; Status: BeagleBone AI TDA4VM; Temperature: -55¡ãC to 125¡ãC
R154 = R: RES, Thick Film, 10K, 1%, 1/16W, SMD, 0402; Part Reference: R154; Manufacturer: YAGEO; Manufacturer Part Number: RC0402FR-074K7L; Company Part Status: BeagleBone Carrier Board; Manufacturer PN: RC0402FR-0710KL; PN: 301010047; CLASS: DISCRETE; PCB Footprint: R0402; Rated Power: 1/16W; Part Type: RES; Status: BeagleBone Carrier Board; Temperature: -55¡ãC to 155¡ãC; Package Size: 0402
R155 = R: RES, Thick Film, 10K, 1%, 1/16W, SMD, 0402; Part Reference: R155; Manufacturer: YAGEO; Manufacturer Part Number: RC0402FR-074K7L; Company Part Status: BeagleBone Carrier Board; Manufacturer PN: RC0402FR-0710KL; PN: 301010047; CLASS: DISCRETE; PCB Footprint: R0402; Rated Power: 1/16W; Part Type: RES; Status: BeagleBone Carrier Board; Temperature: -55¡ãC to 155¡ãC; Package Size: 0402
R156 = R: RES, Thick Film, 10K, 1%, 1/16W, SMD, 0402; Part Reference: R156; Manufacturer PN: RC0402FR-0710KL; Company Part Status: BeagleBone Carrier Board; Manufacturer: YAGEO; Manufacturer Part Number: RC0201FR-0710KL; CLASS: DISCRETE; PN: 301010047; PCB Footprint: R0402; Rated Power: 1/16W; Package Size: 0402; Part Type: RES; Status: BeagleBone AI TDA4VM; Temperature: -55¡ãC to 125¡ãC
R157 = R: RES, Thick Film, 10K, 1%, 1/16W, SMD, 0402; Part Reference: R157; Manufacturer PN: RC0402FR-0710KL; Company Part Status: BeagleBone Carrier Board; Manufacturer Part Number: RC0201FR-0710KL; Manufacturer: YAGEO; CLASS: DISCRETE; PN: 301010047; PCB Footprint: R0402; Rated Power: 1/16W; Package Size: 0402; Temperature: -55¡ãC to 125¡ãC; Status: BeagleBone AI TDA4VM; Part Type: RES
R158 = R: RES, Thick Film, 10K, 1%, 1/16W, SMD, 0402; Part Reference: R158; Manufacturer PN: RC0402FR-0710KL; Company Part Status: BeagleBone Carrier Board; Manufacturer: YAGEO; Manufacturer Part Number: RC0402FR-074K7L; CLASS: DISCRETE; PN: 301010047; PCB Footprint: R0402; Rated Power: 1/16W; Package Size: 0402; Part Type: RES; Status: BeagleBone Carrier Board; Temperature: -55¡ãC to 155¡ãC
R162 = R: RES, Thick Film, 10K, 1%, 1/16W, SMD, 0402; Part Reference: R162; Manufacturer PN: RC0402FR-0710KL; Manufacturer: YAGEO; Company Part Status: BeagleBone Carrier Board; Manufacturer Part Number: YAGEO;RC0402JR-0710KL; CLASS: DISCRETE; PN: 301010047; SIGNAL_MODEL: DEFAULT_RESISTOR_10000OHM_1_2; PCB Footprint: R0402; Rated Power: 1/16W; Package Size: 0402; Part Type: RES; Status: BeagleBone Carrier Board
R163 = R: RES, Thick Film, 0R, 5%, 1/16W, SMD, 0402; Part Reference: R163; Manufacturer PN: RC0402JR-070RL; Manufacturer: YAGEO; Company Part Status: BeagleBone Carrier Board; Manufacturer Part Number: YAGEO;RC0402JR-070RL; CLASS: DISCRETE; PN: 301010000; SIGNAL_MODEL: DEFAULT_RESISTOR_0.001OHM_1_2; PCB Footprint: R0402; Rated Power: 1/16W; Package Size: 0402; Part Type: RES; Status: BeagleBone Carrier Board
R209 = R: RES, Thick Film, 10K, 1%, 1/16W, SMD, 0402; Part Reference: R209; Manufacturer Part Number: RC0201FR-0710KL; Manufacturer: YAGEO; Company Part Status: BeagleBone Carrier Board; Manufacturer PN: RC0402FR-0710KL; PN: 301010047; CLASS: DISCRETE; PCB Footprint: R0402; Temperature: -55¡ãC to 125¡ãC; Status: BeagleBone AI TDA4VM; Part Type: RES; Package Size: 0402; Rated Power: 1/16W
R213 = R: RES, Thick Film, 10K, 1%, 1/16W, SMD, 0402; Part Reference: R213; Manufacturer PN: RC0402FR-0710KL; Company Part Status: BeagleBone Carrier Board; Manufacturer Part Number: RC0201FR-0710KL; Manufacturer: YAGEO; CLASS: DISCRETE; PN: 301010047; PCB Footprint: R0402; Rated Power: 1/16W; Package Size: 0402; Temperature: -55¡ãC to 125¡ãC; Status: BeagleBone AI TDA4VM; Part Type: RES
U1 = AM62x_BGA425: as U1 on sheet 017_SoC CSI & OLDI; PCB Footprint: bga425_0d5_13x13mm; CLASS: IC
U10 = SN74LVC2G241: IC, Logic, Buffer, SN74LVC2G241DCUR, 8-VFSOP; Part Reference: U10; Manufacturer: TI; Company Part Status: BeagleBone Carrier Board; PN: 310050078; PCB Footprint: U_8_DCU; Temperature: -40¡ãC to 125¡ãC; Status: BeagleBone Carrier Board; Manufacturer Part Number: SN74LVC2G241DCUR; Part Type: Buffer; CLASS: IC; Manufacturer PN: SN74LVC2G241DCUR
U18 = DS1339_8P: IC, Misc, RTC, BQ32002, 8-SOIC(3.9mm); Part Reference: U18; Manufacturer PN: BQ32002DR; Manufacturer: TI; Company Part Status: BeaglePlay; PN: 310110503; PCB Footprint: soic8_1d27_4_9x3_9mm; CLASS: IC
U20 = MEM_24LC32_SOT23-5: IC, Memory Devices, EEPROM, FT24C32A-ELRT, SOT-23-5; Part Reference: U20; Company Part Status: BeagleV-Ahead; Manufacturer: FMD; Manufacturer Part Number: 24FC04HT-I/OT; PN: 310091347; Priority: A; PCB Footprint: sot23-5; Manufacturer PN: FT24C32A-ELRT; CLASS: IC; Part Type: EEPROM; Status: BeagleBone AI TDA4VM; Temperature: -40¡ãC to 85¡ãC
X7 = XTAL_2P: Crystal, SMD, 32.768kHz, 20 ppm, 12.5pF; Part Reference: X7; Manufacturer Part Number: Kyocera;ST3215SB32768H5HPWAA; Company Part Status: BeagleBone Carrier Board; Manufacturer: EPCOS; Manufacturer PN: FC-135 32.7680KA-A3; Rating: 20ppm; PN: 306010138; Frequency Tolerance: 20 ppm; CLASS: DISCRETE; PCB Footprint: X2_SMD_3_2X1_5MM; Status: Combox Pro; Part Type: Crystal